# EAGLE design communication-v00 (EAGLE 6.3)
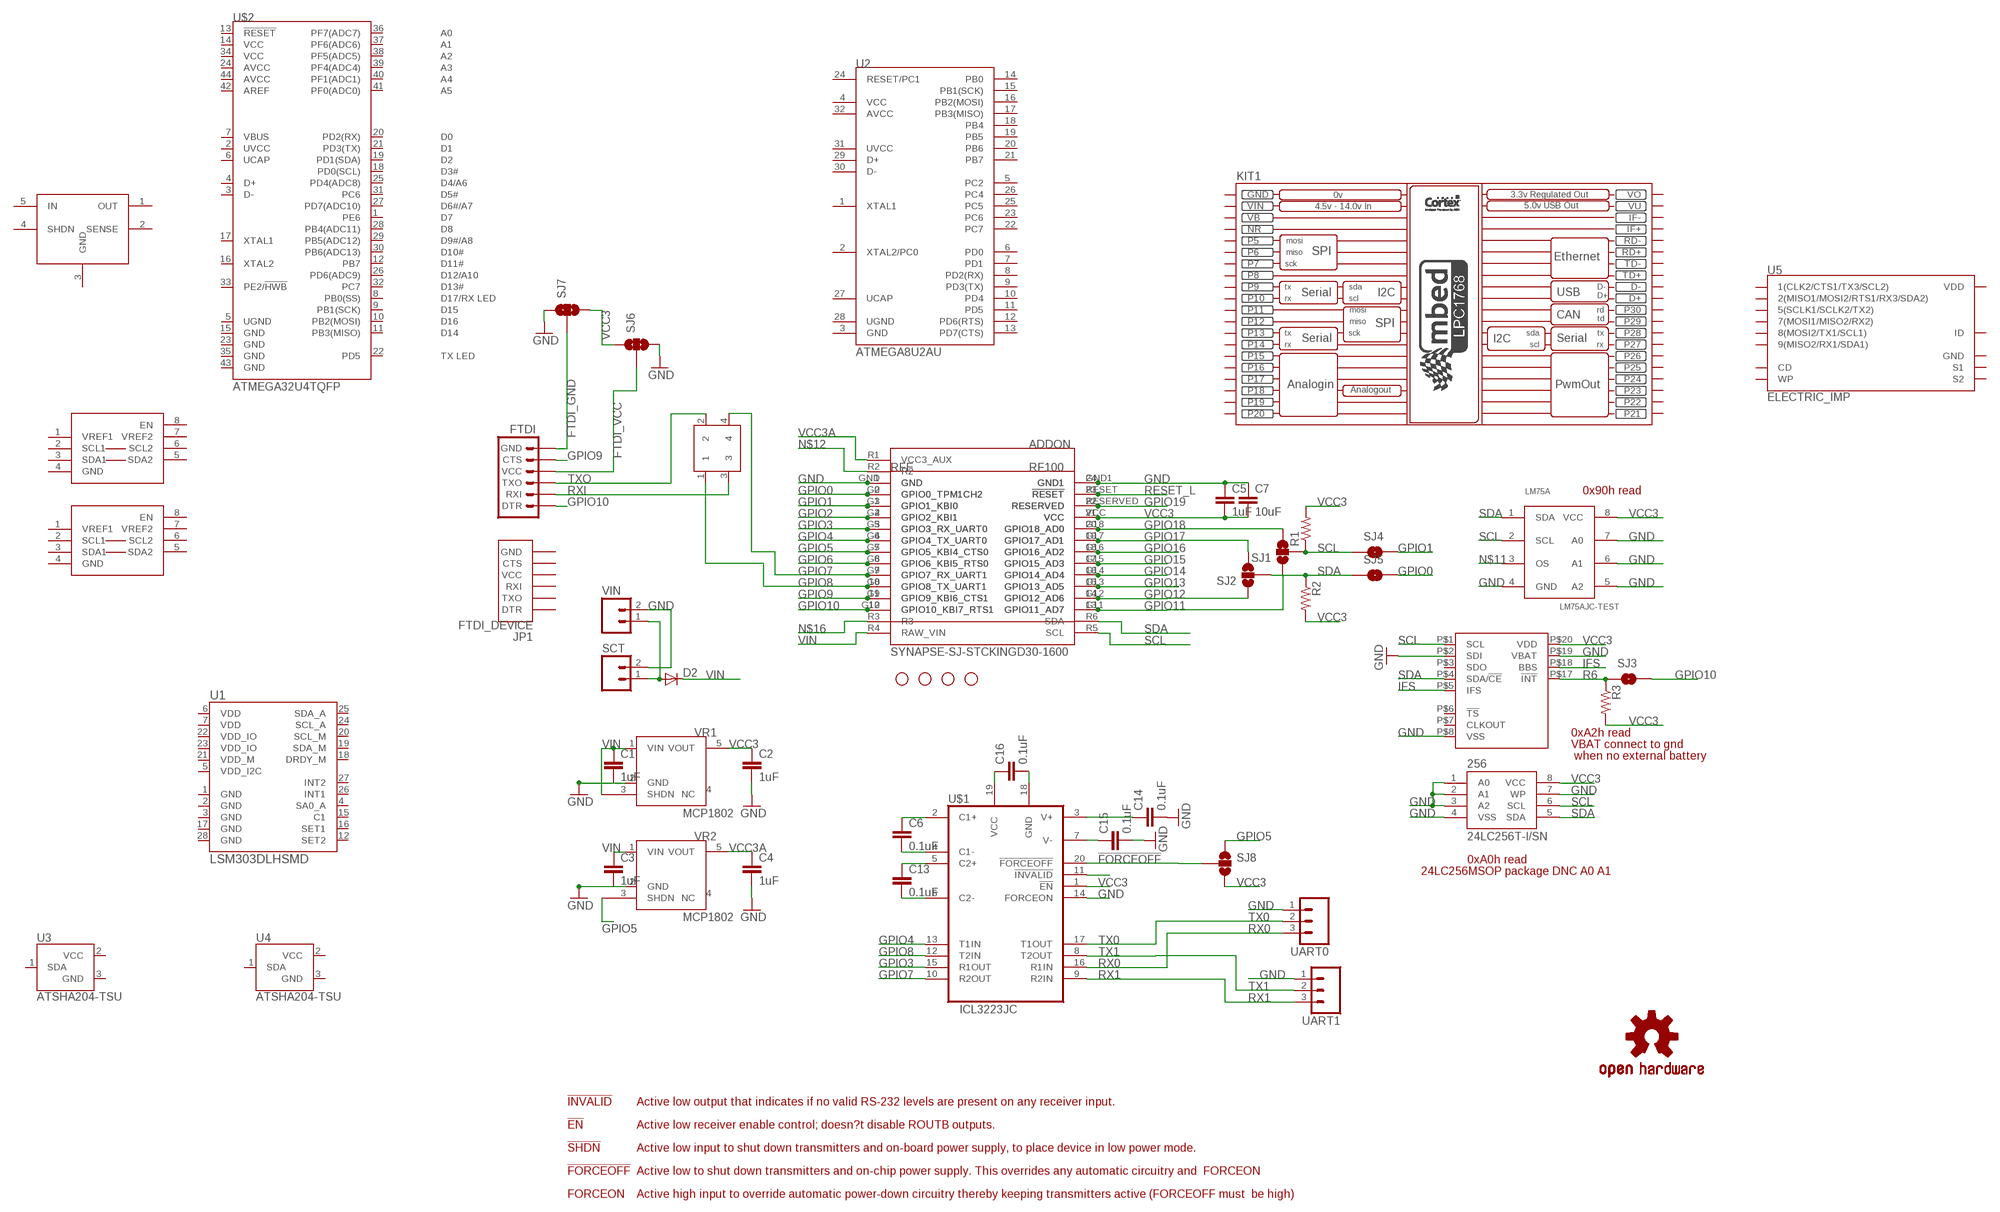
[diagram p0: schematic, sheet 1]

## Parts
256  24LC256T-I/SN  EEPROM-I2CSMD  [SO08]
ADDON  SYNAPSE-SJ-STCKINGD30-1600  [SYNSJ-STACK]
C1  1uF  CAP0805  [0805]
C2  1uF  CAP0805  [0805]
C3  1uF  CAP0805  [0805]
C4  1uF  CAP0805  [0805]
C5  1uF  CAP0805  [0805]
C6  0.1uF  CAP0805  [0805]
C7  10uF  CAP0805  [0805]
C13  0.1uF  CAP0805  [0805]
C14  0.1uF  CAP0805  [0805]
C15  0.1uF  CAP0805  [0805]
C16  0.1uF  CAP0805  [0805]
D2  DIODESMA  [SMA-DIODE]
FTDI  ARDUINO_SERIAL_PROGRAMPTH  [1X06]
JP1  FTDI_DEVICE  [FTDI_DEVICE_SIDE]
JP6  STAND-OFF  [STAND-OFF]
JP9  STAND-OFF  [STAND-OFF]
JP10  STAND-OFF  [STAND-OFF]
JP11  STAND-OFF  [STAND-OFF]
KIT1  MBED_NXP_LPC1768  [MBED-KIT]
LM75A  LM75AJC-TEST  [TSSOP8-3MM]
LOGO1  OSHW-LOGOL  [OSHW-LOGO-L]
PCF2129A  PCF2129ASO20  [SO20W]
R1  RESISTOR  [0805]
R2  RESISTOR  [0805]
R3  RESISTOR  [0805]
RFE  RFE  RF100-JACKJACK2  [SYNAPSERFENGINE-THM-SMT-JACK2]
RXTX  SERIAL_CROSSOVER  [2X02_PTH]
SCT  M023.5MM  [SCREWTERMINAL-3.5MM-2]
SJ1  SOLDERJUMPER_2WAYS  [SJ_3]
SJ2  SOLDERJUMPER_2WAYS  [SJ_3]
SJ3  SOLDERJUMPERNC2  [SJ_2S-NOTRACE]
SJ4  SOLDERJUMPERNO  [SJ_2S-NO]
SJ5  SOLDERJUMPERNO  [SJ_2S-NO]
SJ6  SOLDERJUMPER_2WAYPASTE1&2  [SJ_3_PASTE1&2]
SJ7  SOLDERJUMPER_2WAYPASTE1&2  [SJ_3_PASTE1&2]
SJ8  SOLDERJUMPER_2WAYPASTE1&2  [SJ_3_PASTE1&2]
U1  LSM303DLHSMD  [LGA28-5X5]
U2  ATMEGA8U2AU  [TQFP32-08]
U3  ATSHA204-TSU  [SOT23-3]
U4  ATSHA204-TSU  [SOT23-3]
U5  ELECTRIC_IMP  [SD_MMC_SOCKET]
U$1  ICL3223JC  [TSSOP20-JC]
U$2  ATMEGA32U4TQFP  [SPARKFUN-DIGITALIC_TQFP44]
U$3  PCA9306  [PSOP-8]
U$4  PCA9306  [PSOP-8]
U$5  LT1528  [Q5-DD]
UART0  M03PTH  [1X03]
UART1  M03PTH  [1X03]
VIN  M02PTH  [1X02]
VR1  MCP1802  [SOT23-5]
VR2  MCP1802  [SOT23-5]

## Nets
!FORCEOFF: SJ8.2 U$1.20(!FORCEOFF)
!INVALID: U$1.11(!INVALID)
FTDI_GND: FTDI.6(GND) SJ7.2
FTDI_VCC: FTDI.4(VCC) SJ6.2
GND: 256.1(A0) 256.2(A1) 256.3(A2) 256.4(VSS) 256.7(WP) ADDON.GND ADDON.GND1 C1.2 C2.2 C3.2 C4.2 C5.1 C7.1 C14.2 C15.2 C16.2 LM75A.4(GND) LM75A.5(A2) LM75A.6(A1) LM75A.7(A0) PCF2129A.P$2(SDI) PCF2129A.P$8(VSS) PCF2129A.P$19(VBAT) RFE.1(GND) RFE.24(GND1) RFE.P1 RFE.P24 RFE.P201 RFE.P224 SCT.2 SJ6.3 SJ7.1 U$1.14(FORCEON) U$1.18(GND) UART0.1 UART1.1 VIN.2 VR1.2(GND) VR2.2(GND)
GPIO0: ADDON.G0(GPIO0_TPM1CH2) RFE.2(GPIO0_TPM1CH2) RFE.P2 RFE.P202 SJ5.2
GPIO1: ADDON.G1(GPIO1_KBI0) RFE.3(GPIO1_KBI0) RFE.P3 RFE.P203 SJ4.2
GPIO2: ADDON.G2(GPIO2_KBI1) RFE.4(GPIO2_KBI1) RFE.P4 RFE.P204
GPIO3: ADDON.G3(GPIO3_RX_UART0) RFE.5(GPIO3_RX_UART0) RFE.P5 RFE.P205 U$1.15(R1OUT)
GPIO4: ADDON.G4(GPIO4_TX_UART0) RFE.6(GPIO4_TX_UART0) RFE.P6 RFE.P206 U$1.13(T1IN)
GPIO5: ADDON.G5(GPIO5_KBI4_CTS0) RFE.7(GPIO5_KBI4_CTS0) RFE.P7 RFE.P207 SJ8.1 VR2.3(SHDN)
GPIO6: ADDON.G6(GPIO6_KBI5_RTS0) RFE.8(GPIO6_KBI5_RTS0) RFE.P8 RFE.P208
GPIO7: ADDON.G7(GPIO7_RX_UART1) RFE.9(GPIO7_RX_UART1) RFE.P9 RFE.P209 RXTX.4 U$1.10(R2OUT)
GPIO8: ADDON.G8(GPIO8_TX_UART1) RFE.10(GPIO8_TX_UART1) RFE.P10 RFE.P210 RXTX.1 U$1.12(T2IN)
GPIO9: ADDON.G9(GPIO9_KBI6_CTS1) FTDI.5(CTS) RFE.11(GPIO9_KBI6_CTS1) RFE.P11 RFE.P211
GPIO10: ADDON.G10(GPIO10_KBI7_RTS1) FTDI.1(DTR) RFE.12(GPIO10_KBI7_RTS1) RFE.P12 RFE.P212 SJ3.2
GPIO11: ADDON.G11(GPIO11_AD7) RFE.13(GPIO11_AD7) RFE.P13 RFE.P213 SJ1.1
GPIO12: ADDON.G12(GPIO12_AD6) RFE.14(GPIO12_AD6) RFE.P14 RFE.P214 SJ2.1
GPIO13: ADDON.G13(GPIO13_AD5) RFE.15(GPIO13_AD5) RFE.P15 RFE.P215
GPIO14: ADDON.G14(GPIO14_AD4) RFE.16(GPIO14_AD4) RFE.P16 RFE.P216
GPIO15: ADDON.G15(GPIO15_AD3) RFE.17(GPIO15_AD3) RFE.P17 RFE.P217
GPIO16: ADDON.G16(GPIO16_AD2) RFE.18(GPIO16_AD2) RFE.P18 RFE.P218
GPIO17: ADDON.G17(GPIO17_AD1) RFE.19(GPIO17_AD1) RFE.P19 RFE.P219 SJ2.3
GPIO18: ADDON.G18(GPIO18_AD0) RFE.20(GPIO18_AD0) RFE.P20 RFE.P220 SJ1.3
GPIO19: ADDON.RESERVED RFE.22(RESERVED) RFE.P22 RFE.P222
IFS: PCF2129A.P$5(IFS) PCF2129A.P$18(BBS)
N$1: C13.1 U$1.5(C2+)
N$2: C13.2 U$1.6(C2-)
N$3: C6.1 U$1.2(C1+)
N$5: C6.2 U$1.4(C1-)
N$9: C14.1 U$1.3(V+)
N$10: C15.1 U$1.7(V-)
N$11: LM75A.3(OS)
N$12: ADDON.R2
N$16: ADDON.R3
R6: PCF2129A.P$17(!INT) R3.1 SJ3.1
RESET_L: ADDON.RESET(!RESET) RFE.23(!RESET) RFE.P23 RFE.P223
RX0: U$1.16(R1IN) UART0.3
RX1: U$1.9(R2IN) UART1.3
RXI: FTDI.2(RXI) RXTX.3
SCL: 256.6(SCL) ADDON.R5(SCL) LM75A.2(SCL) PCF2129A.P$1(SCL) R1.1 SJ1.2 SJ4.1
SDA: 256.5(SDA) ADDON.R6(SDA) LM75A.1(SDA) PCF2129A.P$4(SDA/!CE) R2.1 SJ2.2 SJ5.1
TX0: U$1.17(T1OUT) UART0.2
TX1: U$1.8(T2OUT) UART1.2
TXO: FTDI.3(TXO) RXTX.2
VCC3: 256.8(VCC) ADDON.VCC C2.1 C5.2 C7.2 C16.1 LM75A.8(VCC) PCF2129A.P$20(VDD) R1.2 R2.2 R3.2 RFE.21(VCC) RFE.P21 RFE.P221 SJ6.1 SJ7.3 SJ8.3 U$1.1(!EN) U$1.19(VCC) VR1.5(VOUT)
VCC3A: ADDON.R1(VCC3_AUX) C4.1 VR2.5(VOUT)
VIN: ADDON.R4(RAW_VIN) C1.1 C3.1 D2.C VR1.1(VIN) VR1.3(SHDN) VR2.1(VIN)
VIN_PREDIODE: D2.A SCT.1 VIN.1
Unconnected: JP1.P$1(DTR) JP1.P$2(TXO) JP1.P$3(RXI) JP1.P$4(VCC) JP1.P$5(CTS) JP1.P$6(GND) KIT1.D+ KIT1.D- KIT1.IF+ KIT1.IF- KIT1.P$5(P5) KIT1.P$6(P6) KIT1.P$7(P7) KIT1.P$8(P8) KIT1.P$9(P9) KIT1.P$10(P10) KIT1.P$11(P11) KIT1.P$12(P12) KIT1.P$13(P13) KIT1.P$14(P14) KIT1.P$15(P15) KIT1.P$16(P16) KIT1.P$17(P17) KIT1.P$18(P18) KIT1.P$19(P19) KIT1.P$20(P20) KIT1.P$21(P21) KIT1.P$22(P22) KIT1.P$23(P23) KIT1.P$24(P24) KIT1.P$25(P25) KIT1.P$26(P26) KIT1.P$27(P27) KIT1.P$28(P28) KIT1.P$29(P29) KIT1.P$30(P30) KIT1.RD+ KIT1.RD- KIT1.TD+ KIT1.TD- PCF2129A.P$3(SDO) PCF2129A.P$6(!TS) PCF2129A.P$7(CLKOUT) U1.1(GND) U1.2(GND) U1.3(GND) U1.4(SA0_A) U1.5(VDD_I2C) U1.6(VDD) U1.7(VDD) U1.12(SET2) U1.15(C1) U1.16(SET1) U1.17(GND) U1.18(DRDY_M) U1.19(SDA_M) U1.20(SCL_M) U1.21(VDD_M) U1.22(VDD_IO) U1.23(VDD_IO) U1.24(SCL_A) U1.25(SDA_A) U1.26(INT1) U1.27(INT2) U1.28(GND) U2.1(XTAL1) U2.2(XTAL2/PC0) U2.3(GND) U2.4(VCC) U2.5(PC2) U2.6(PD0) U2.7(PD1) U2.8(PD2(RX)) U2.9(PD3(TX)) U2.10(PD4) U2.11(PD5) U2.12(PD6(RTS)) U2.13(PD7(CTS)) U2.14(PB0) U2.15(PB1(SCK)) U2.16(PB2(MOSI)) U2.17(PB3(MISO)) U2.18(PB4) U2.19(PB5) U2.20(PB6) U2.21(PB7) U2.22(PC7) U2.23(PC6) U2.24(RESET/PC1) U2.25(PC5) U2.26(PC4) U2.27(UCAP) U2.28(UGND) U2.29(D+) U2.30(D-) U2.31(UVCC) U2.32(AVCC) U3.1(SDA) U3.2(VCC) U3.3(GND) U4.1(SDA) U4.2(VCC) U4.3(GND) U5.1(1(CLK2/CTS1/TX3/SCL2)) U5.2(2(MISO1/MOSI2/RTS1/RX3/SDA2)) U5.3(GND) U5.4(VDD) U5.5(5(SCLK1/SCLK2/TX2)) U5.6(ID) U5.7(7(MOSI1/MISO2/RX2)) U5.8(8(MOSI2/TX1/SCL1)) U5.9(9(MISO2/RX1/SDA1)) U5.CD U5.S1 U5.S2 U5.WP U$2.1(PE6) U$2.2(UVCC) U$2.3(D-) U$2.4(D+) U$2.5(UGND) U$2.6(UCAP) U$2.7(VBUS) U$2.8(PB0(SS)) U$2.9(PB1(SCK)) U$2.10(PB2(MOSI)) U$2.11(PB3(MISO)) U$2.12(PB7) U$2.13(!RESET) U$2.14(VCC) U$2.15(GND) U$2.16(XTAL2) U$2.17(XTAL1) U$2.18(PD0(SCL)) U$2.19(PD1(SDA)) U$2.20(PD2(RX)) U$2.21(PD3(TX)) U$2.22(PD5) U$2.23(GND) U$2.24(AVCC) U$2.25(PD4(ADC8)) U$2.26(PD6(ADC9)) U$2.27(PD7(ADC10)) U$2.28(PB4(ADC11)) U$2.29(PB5(ADC12)) U$2.30(PB6(ADC13)) U$2.31(PC6) U$2.32(PC7) U$2.33(PE2/!HWB) U$2.34(VCC) U$2.35(GND) U$2.36(PF7(ADC7)) U$2.37(PF6(ADC6)) U$2.38(PF5(ADC5)) U$2.39(PF4(ADC4)) U$2.40(PF1(ADC1)) U$2.41(PF0(ADC0)) U$2.42(AREF) U$2.43(GND) U$2.44(AVCC) U$3.1(VREF1) U$3.2(SCL1) U$3.3(SDA1) U$3.4(GND) U$3.5(SDA2) U$3.6(SCL2) U$3.7(VREF2) U$3.8(EN) U$4.1(VREF1) U$4.2(SCL1) U$4.3(SDA1) U$4.4(GND) U$4.5(SDA2) U$4.6(SCL2) U$4.7(VREF2) U$4.8(EN) U$5.1(OUT) U$5.2(SENSE) U$5.3(GND) U$5.4(SHDN) U$5.5(IN) VR1.4(NC) VR2.4(NC)

## Notes on the sheet
- 0x90h read
- 0xA2h read
- VBAT connect to gnd
- when no external battery
- 0xA0h read
- 24LC256MSOP package DNC A0 A1
- !INVALID | Active low output that indicates if no valid RS-232 levels are present on any receiver input.
- !EN | Active low receiver enable control; doesn?t disable ROUTB outputs.
- !SHDN | Active low input to shut down transmitters and on-board power supply, to place device in low power mode.
- !FORCEOFF | Active low to shut down transmitters and on-chip power supply. This overrides any automatic circuitry and  FORCEON
- FORCEON | Active high input to override automatic power-down circuitry thereby keeping transmitters active (FORCEOFF must  be high)

## Power pins joined to a net without a drawn wire
GND: KIT1.GND
NR: KIT1.NR
VB: KIT1.VB
VIN: KIT1.VIN
VO: KIT1.VOUT(VO)
VU: KIT1.VU

## Library data of the parts
256 = SparkFun:EEPROM-I2C
ADDON = 0_jc-custom:SYNAPSE-SJ-STCKING: Standard layout for expansion modules using Synapse Wireless boards
C1-C7 C13-C16 = 0_jc-custom:CAP: Capacitor Standard 0603 ceramic capacitor, and 0.1" leaded capacitor.
D2 = SparkFun:DIODE: Diode These are standard reverse protection diodes and small signal diodes. SMA package can handle up to about 1A. SOD-323 can handle about 200mA. What the SOD-323 package when ordering, there are some mfgs out there that are 5-pin packages.
FTDI = SparkFun:ARDUINO_SERIAL_PROGRAM
JP1 = SparkFun-Connectors:FTDI_DEVICE: Connector which mates to FTDI basic or FTDI cable.
JP6 JP9-JP11 = SparkFun:STAND-OFF: Stand Off This is the mechanical footprint for a #4 phillips button head screw. Use the keepout ring to avoid running the screw head into surrounding components. SKU : PRT-00447
KIT1 = MBED_v2.1:MBED_NXP_LPC1768: Mbed LPC1768 - ARM CORTEX v2.1 * Schematic symbol is now placed in eagles's default raster. *The pads diameter are suitable for routing between mbed pins * mbed pads are 0.8 mm drill diameter. --------------------------------------------- Created by: Mohamed Yousry *Alexandria, Egypt *Email: mohamed.yousry@ieeegoldegypt.org
LM75A = 0_jc-custom:LM75A
LOGO1 = SparkFun-Aesthetics:OSHW-LOGO: Open Source Hardware Logo This logo indicates the piece of hardware it is found on incorporates a OSHW license and/or adheres to the definition of open source hardware found here: http://freedomdefined.org/OSHW
PCF2129A = 0_jc-custom:PCF2129A
R1-R3 = SparkFun:RESISTOR: Resistor Basic schematic elements and footprints for 0603, 1206, and PTH 1/10th watt (small) resistors.
RFE = 0_jc-custom:RF100-JACK
RXTX = 0_jc-custom:SERIAL_CROSSOVER
SCT VIN = SparkFun:M02: Header 2 Standard 2-pin 0.1" header. Use with straight break away headers (SKU : PRT-00116), right angle break away headers (PRT-00553), swiss pins (PRT-00743), machine pins (PRT-00117), and female headers (PRT-00115). Molex polarized connector foot print use with SKU : PRT-08233 with associated crimp pins and housings.
SJ1 SJ2 SJ6-SJ8 = SparkFun:SOLDERJUMPER_2WAY: Solder Jumper 2 way solder jumper
SJ3-SJ5 = SparkFun:SOLDERJUMPER: Solder Jumper Standard SMD solder jumper. Used to automate production. Two varients : Normally Open and Normally Closed are the same, but have different paste layers. NC will have a large amount of paste and should jumper during reflow.
U1 = SparkFun-Sensors:LSM303DLH: I2C accelerometer/magnetometer/tilt compensated compass
U2 = SparkFun-DigitalIC:ATMEGA8U2: Atmel 32-pin 8-bit Microcontroller with 8/16/32K Bystes of ISP Flash and USB Controller. ATmega8U2, ATmega16U2, and ATmega32U2
U3 U4 = SparkFun-DigitalIC:ATSHA204: Atmel ATSHA204 The Atmel ATSHA204 is an optimized authentication chip that includes a 4.5Kb EEPROM. This array can be used for storage of keys, miscellaneous read/write, read-only, password or secret data, and consumption tracking. Access to the various sections of memory can be restricted in a variety of ways and then the configuration locked to prevent changes.
U5 = SparkFun-RF:ELECTRIC_IMP: Electric Imp SD Socket This symbol matches the Electric Imp <https://www.sparkfun.com/products/11395> pinout to a 4UCONN SD MMC connector. The 4UCONN part number is 19646 <http://www.4uconnector.com/online/Itemadrawing.asp?fldseries=19646&seriesno_a=12>. See this part in action on the Electric Imp Breakout <https://www.sparkfun.com/products/11400>.
U$1 = 0_jc-custom:ICL3223
U$2 = SparkFun-DigitalIC:ATMEGA32U4: Atmel 44-pin 8-bit Microcontroller with 32KBytes of ISP Flash and USB Controller
U$3 U$4 = SparkFun-DigitalIC:PCA9306: Bidirectional I2C level shifter. NOT compatible with all available part number pinout schemes- DOUBLE CHECK!!!
U$5 = SparkFun-PowerIC:LT1528: High current voltage regulator commonly used with GM862 cellular module. Spark Fun Electronics SKU : COM-00311. Footprint may need to have the large paste aperature reduced.
UART0 UART1 = SparkFun:M03: Header 3 Standard 3-pin 0.1" header. Use with straight break away headers (SKU : PRT-00116), right angle break away headers (PRT-00553), swiss pins (PRT-00743), machine pins (PRT-00117), and female headers (PRT-00115). Molex polarized connector foot print use with SKU : PRT-08232 with associated crimp pins and housings.
VR1 VR2 = 0_jc-custom:MCP1802

## Net classes
0 default: width 0.254 mm
1 Power: width 0.508 mm
2 smallsignal: width 0.152 mm
3 stdsignal: width 0.254 mm

## Board
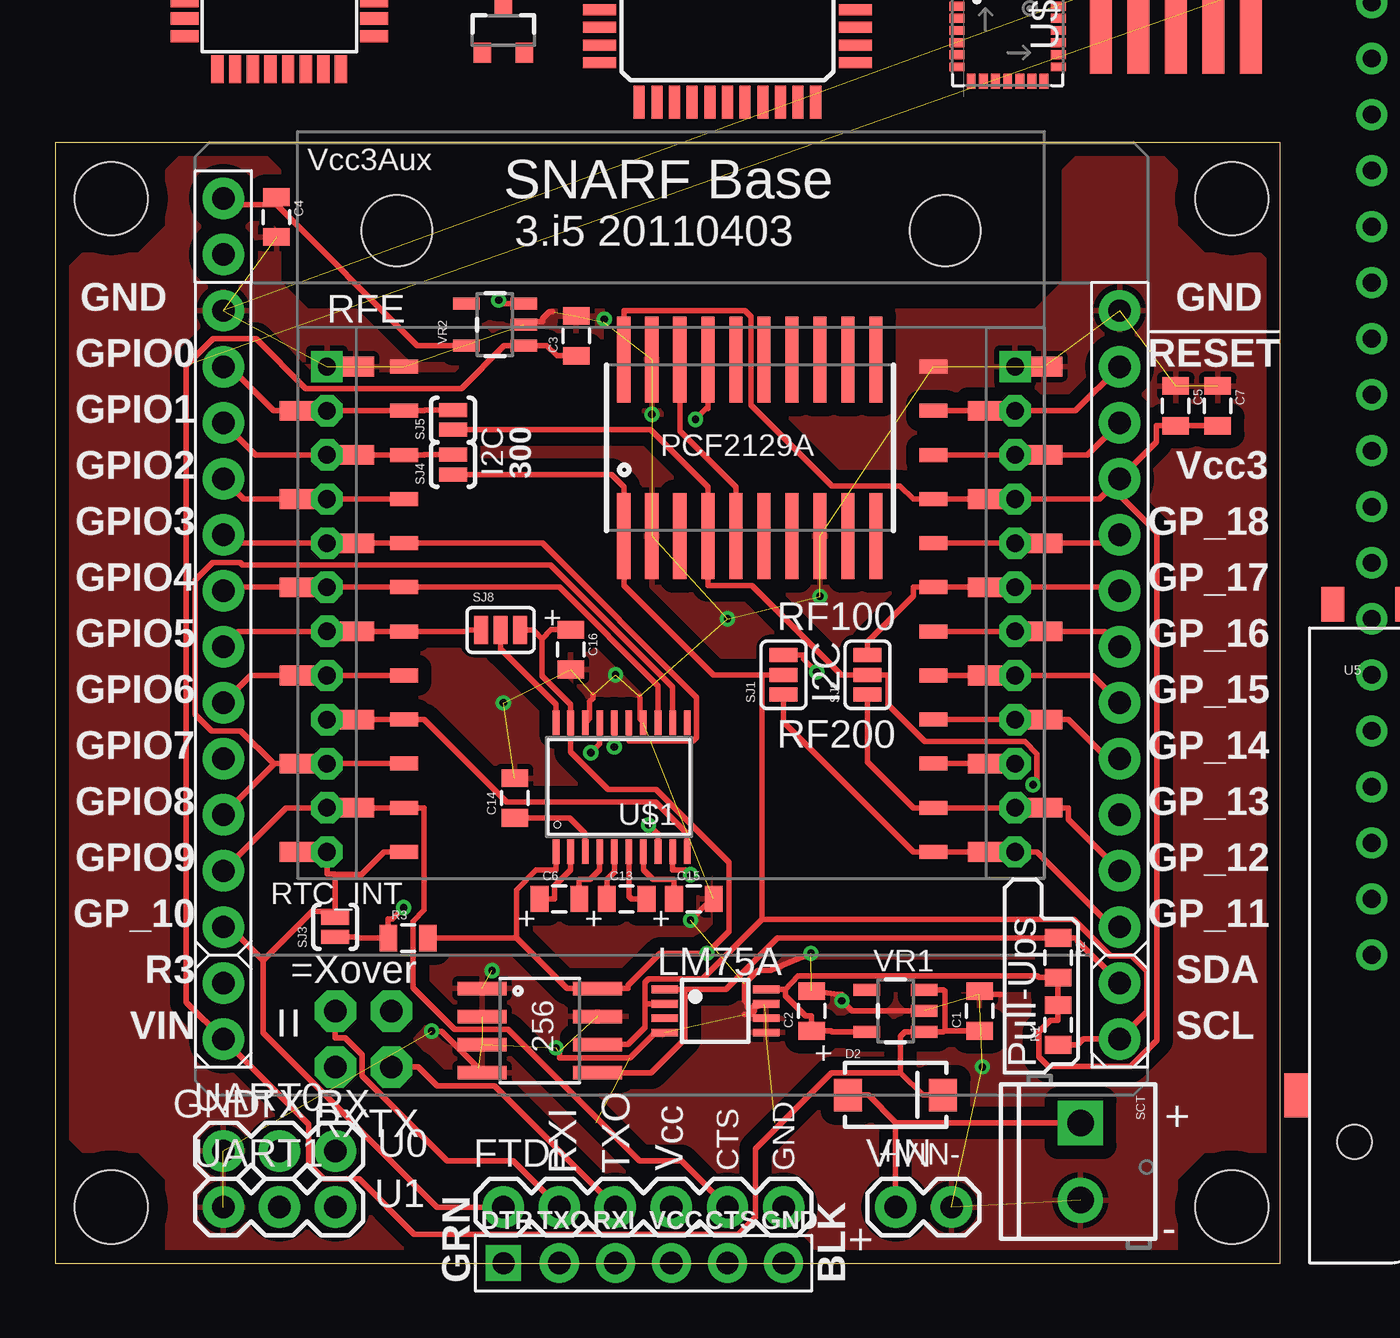
[diagram p1: board, top side]
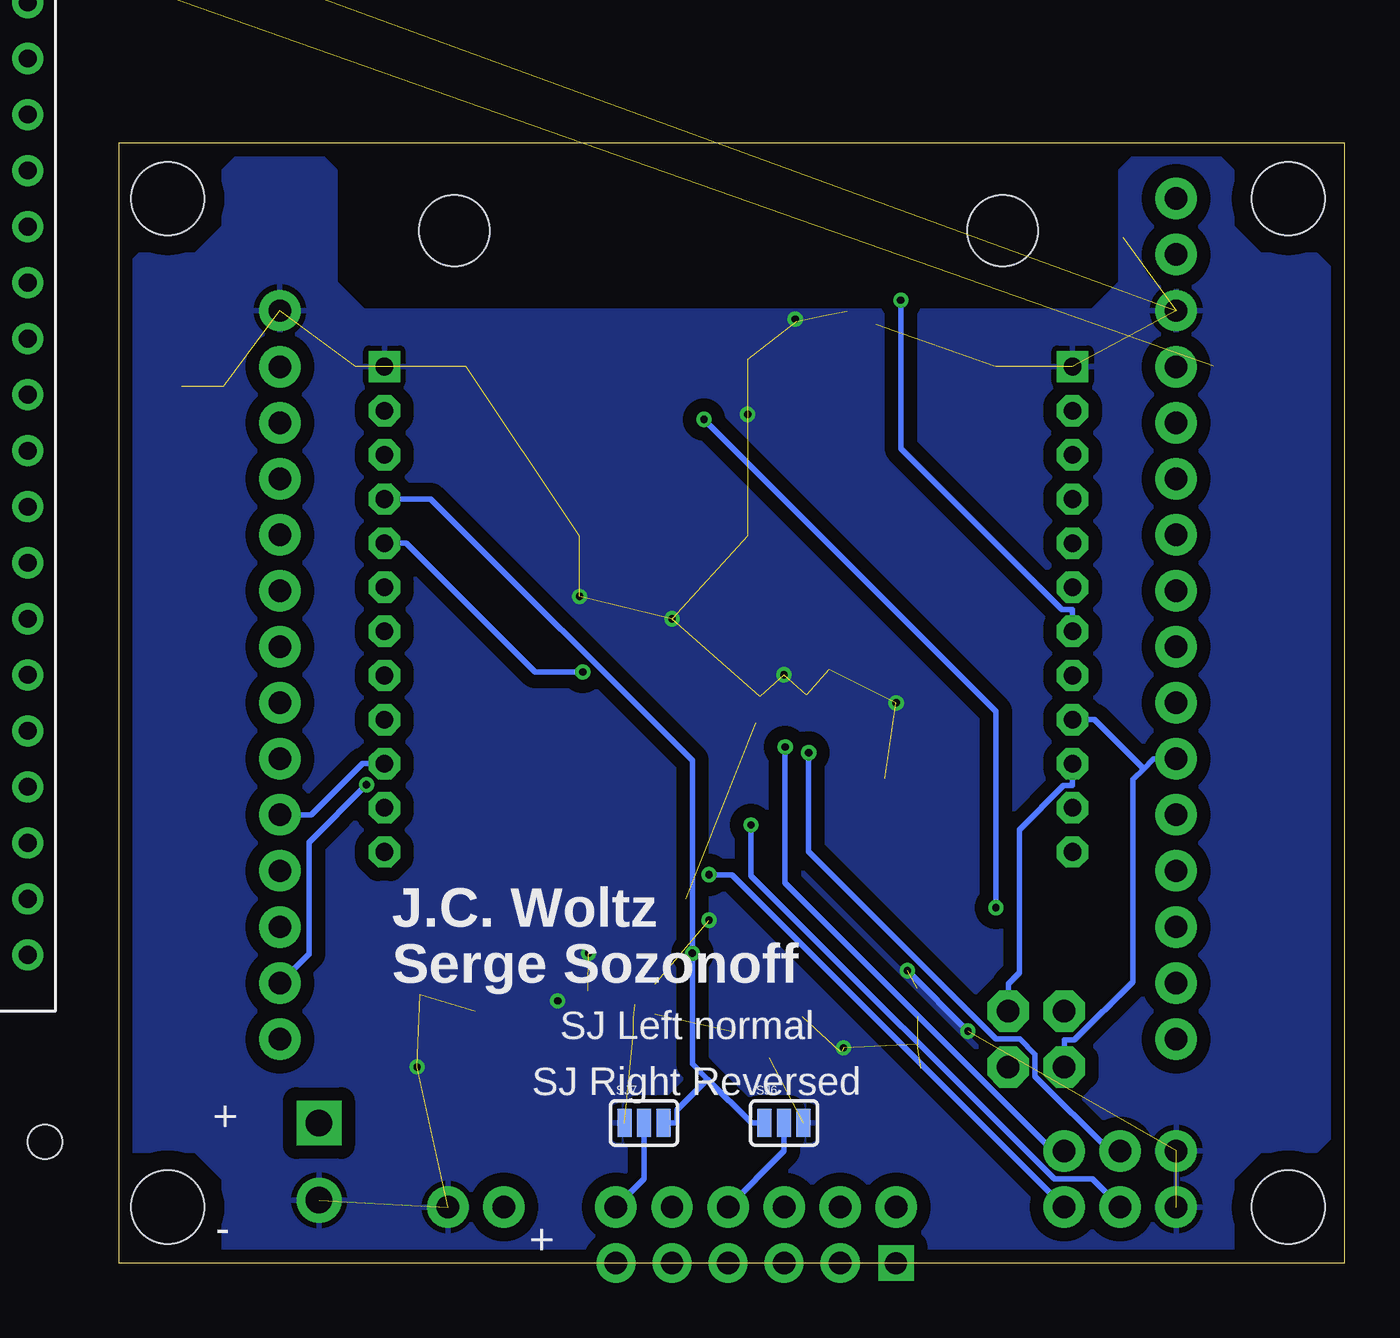
[diagram p2: board, bottom side, seen from below]

Size 55.55 x 50.79 mm. Coordinates in mm from the lower left corner, seen from the top.
Outline: 0,0 55.55,0 55.55,50.79 0,50.79 0,0
Copper layers (1*16): Top 0.0356mm / dielectric 1.5011mm / Bottom 0.0356mm
Design rules "LaenPCBOrder-JCModified": minimum track width 6mil, minimum drill 13mil, track to track 6mil, track to pad 6mil, pad to pad 6mil, via to via 6mil, smd to smd 6mil, copper to edge 15mil, drill to drill 6mil, minimum pad ring 12mil, minimum via ring 7mil, stop-mask expansion 4mil, vias tented up to drill 25mil, thermal gap 10mil

### Footprints (pad centres in the part's own frame; a part is rotated, then mirrored left to right if it is on the bottom)
SO08 = smd 0.61 x 2.21: 1 -1.905,-2.616; 2 -0.635,-2.616; 3 0.635,-2.616; 4 1.905,-2.616; 5 1.905,2.616; 6 0.635,2.616; 7 -0.635,2.616; 8 -1.905,2.616
SYNSJ-STACK = drill 1.016 pad 1.88: G0 0,-7.62; G1 0,-10.16; G2 0,-12.7; G3 0,-15.24; G4 0,-17.78; G5 0,-20.32; G6 0,-22.86; G7 0,-25.4; G8 0,-27.94; G9 0,-30.48; G10 0,-33.02; G11 40.64,-33.02; G12 40.64,-30.48; G13 40.64,-27.94; G14 40.64,-25.4; G15 40.64,-22.86; G16 40.64,-20.32; G17 40.64,-17.78; G18 40.64,-15.24; GND 0,-5.08; GND1 40.64,-5.08; R1 0,0; R2 0,-2.54; R3 0,-35.56; R4 0,-38.1; R5 40.64,-38.1; R6 40.64,-35.56; RESERVED 40.64,-10.16; RESET 40.64,-7.62; VCC 40.64,-12.7
0805 = smd 0.8 x 1.2: 1 -0.9,0; 2 0.9,0
SMA-DIODE = smd 1.27 x 1.47: A -2.15,0; C 2.15,0
1X06 = drill 1.016 pad 1.88: 1 0,0; 2 2.54,0; 3 5.08,0; 4 7.62,0; 5 10.16,0; 6 12.7,0
FTDI_DEVICE_SIDE = drill 1 square: P$1 -6.35,0 | drill 1.016 pad 1.778: P$2 -3.81,0; P$3 -1.27,0; P$4 1.27,0; P$5 3.81,0; P$6 6.35,0
STAND-OFF = hole 3.302: 0,0
MBED-KIT = drill 0.8: D+ 11.43,1.27; D- 11.43,3.81; GND -11.43,24.13; IF+ 11.43,16.51; IF- 11.43,19.05; NR -11.43,16.51; P$5 -11.43,13.97; P$6 -11.43,11.43; P$7 -11.43,8.89; P$8 -11.43,6.35; P$9 -11.43,3.81; P$10 -11.43,1.27; P$11 -11.43,-1.27; P$12 -11.43,-3.81; P$13 -11.43,-6.35; P$14 -11.43,-8.89; P$15 -11.43,-11.43; P$16 -11.43,-13.97; P$17 -11.43,-16.51; P$18 -11.43,-19.05; P$19 -11.43,-21.59; P$20 -11.43,-24.13; P$21 11.43,-24.13; P$22 11.43,-21.59; P$23 11.43,-19.05; P$24 11.43,-16.51; P$25 11.43,-13.97; P$26 11.43,-11.43; P$27 11.43,-8.89; P$28 11.43,-6.35; P$29 11.43,-3.81; P$30 11.43,-1.27; RD+ 11.43,11.43; RD- 11.43,13.97; TD+ 11.43,6.35; TD- 11.43,8.89; VB -11.43,19.05; VIN -11.43,21.59; VOUT 11.43,24.13; VU 11.43,21.59
TSSOP8-3MM = smd 1.2 x 0.35: 1 -2.6,0.975; 2 -2.6,0.325; 3 -2.6,-0.325; 4 -2.6,-0.975; 5 2,-0.975; 6 2,-0.325; 7 2,0.325; 8 2,0.975
SO20W = smd 0.6 x 3.9: P$1 -5.715,-4; P$2 -4.445,-4; P$3 -3.175,-4; P$4 -1.905,-4; P$5 -0.635,-4; P$6 0.635,-4; P$7 1.905,-4; P$8 3.175,-4; P$9 4.445,-4; P$10 5.715,-4; P$11 5.715,4; P$12 4.445,4; P$13 3.175,4; P$14 1.905,4; P$15 0.635,4; P$16 -0.635,4; P$17 -1.905,4; P$18 -3.175,4; P$19 -4.445,4; P$20 -5.715,4
SYNAPSERFENGINE-THM-SMT-JACK2 = drill 0.8 square: 1 0,0; 24 31.2,0 | drill 0.8 pad 1.422 octagon: 2 0,-2; 3 0,-4; 4 0,-6; 5 0,-8; 6 0,-10; 7 0,-12; 8 0,-14; 9 0,-16; 10 0,-18; 11 0,-20; 12 0,-22; 13 31.2,-22; 14 31.2,-20; 15 31.2,-18; 16 31.2,-16; 17 31.2,-14; 18 31.2,-12; 19 31.2,-10; 20 31.2,-8; 21 31.2,-6; 22 31.2,-4; 23 31.2,-2 | smd 1.67 x 0.89: P1 1.3,0; P2 -1.3,-2; P3 1.3,-4; P4 -1.3,-6; P5 1.3,-8; P6 -1.3,-10; P7 1.3,-12; P8 -1.3,-14; P9 1.3,-16; P10 -1.3,-18; P11 1.3,-20; P12 -1.3,-22; P13 29.9,-22; P14 32.5,-20; P15 29.9,-18; P16 32.5,-16; P17 29.9,-14; P18 32.5,-12; P19 29.9,-10; P20 32.5,-8; P21 29.9,-6; P22 32.5,-4; P23 29.9,-2; P24 32.5,0 | smd 1.27 x 0.635: P201 3.5,0; P202 3.5,-2; P203 3.5,-4; P204 3.5,-6; P205 3.5,-8; P206 3.5,-10; P207 3.5,-12; P208 3.5,-14; P209 3.5,-16; P210 3.5,-18; P211 3.5,-20; P212 3.5,-22; P213 27.5,-22; P214 27.5,-20; P215 27.5,-18; P216 27.5,-16; P217 27.5,-14; P218 27.5,-12; P219 27.5,-10; P220 27.5,-8; P221 27.5,-6; P222 27.5,-4; P223 27.5,-2; P224 27.5,0 | hole 3.2: 3.17,6.16; 28.03,6.16
2X02_PTH = drill 1.016 pad 1.88 octagon: 1 -1.27,-1.27; 2 -1.27,1.27; 3 1.27,-1.27; 4 1.27,1.27
SCREWTERMINAL-3.5MM-2 = drill 1.2 pad 2.032 square: 1 0,0 | drill 1.2 pad 2.032: 2 3.5,0
SJ_3 = smd 0.635 x 1.27: 1 -0.889,0; 2 0,0; 3 0.889,0
SJ_2S-NOTRACE = smd 0.635 x 1.27: 1 -0.45,0; 2 0.4,0
SJ_2S-NO = smd 0.635 x 1.27: 1 -0.45,0; 2 0.45,0
SJ_3_PASTE1&2 = smd 0.635 x 1.27: 1 -0.889,0; 2 0,0; 3 0.889,0
LGA28-5X5 = smd 0.7 x 0.4: 1 -2.3,1.65; 2 -2.3,1.1; 3 -2.3,0.55; 4 -2.3,0; 5 -2.3,-0.55; 6 -2.3,-1.1; 7 -2.3,-1.65; 15 2.3,-1.65; 16 2.3,-1.1; 17 2.3,-0.55; 18 2.3,0; 19 2.3,0.55; 20 2.3,1.1; 21 2.3,1.65 | smd 0.4 x 0.7: 8 -1.65,-2.3; 9 -1.1,-2.3; 10 -0.55,-2.3; 11 0,-2.3; 12 0.55,-2.3; 13 1.1,-2.3; 14 1.65,-2.3; 22 1.65,2.3; 23 1.1,2.3; 24 0.55,2.3; 25 0,2.3; 26 -0.55,2.3; 27 -1.1,2.3; 28 -1.65,2.3
TQFP32-08 = smd 1.27 x 0.559: 1 -4.293,2.8; 2 -4.293,2; 3 -4.293,1.2; 4 -4.293,0.4; 5 -4.293,-0.4; 6 -4.293,-1.2; 7 -4.293,-2; 8 -4.293,-2.8; 17 4.293,-2.8; 18 4.293,-2; 19 4.293,-1.2; 20 4.293,-0.4; 21 4.293,0.4; 22 4.293,1.2; 23 4.293,2; 24 4.293,2.8 | smd 0.559 x 1.27: 9 -2.8,-4.293; 10 -2,-4.293; 11 -1.2,-4.293; 12 -0.4,-4.293; 13 0.4,-4.293; 14 1.2,-4.293; 15 2,-4.293; 16 2.8,-4.293; 25 2.8,4.293; 26 2,4.293; 27 1.2,4.293; 28 0.4,4.293; 29 -0.4,4.293; 30 -1.2,4.293; 31 -2,4.293; 32 -2.8,4.293
SOT23-3 = smd 0.8 x 0.9: 1 -0.95,-1; 2 0.95,-1; 3 0,1.1
SD_MMC_SOCKET = smd 1.05 x 1.56: 1 6.77,29.87; 2 4.27,29.87; 3 2.52,29.87; 4 -0.73,29.87; 5 -3.23,29.87; 6 -5.73,29.87; 7 -8.15,29.87; 8 -9.85,29.87; 9 9.27,29.87; CD 1.02,29.87; WP -13.2,29.87 | smd 1.2 x 2: S1 -14.8,7.6; S2 14.8,8.8 | hole 1.55: 11.98,5.5; -12.22,5.5
TSSOP20-JC = smd 1.1 x 0.3: 1 -2.937,2.693; 2 -2.937,2.032; 3 -2.937,1.372; 4 -2.937,0.712; 5 -2.937,0.051; 6 -2.937,-0.609; 7 -2.937,-1.27; 8 -2.943,-1.93; 9 -2.937,-2.59; 10 -2.937,-3.251; 11 2.905,-3.251; 12 2.905,-2.59; 13 2.911,-1.93; 14 2.905,-1.27; 15 2.905,-0.609; 16 2.905,0.051; 17 2.905,0.712; 18 2.905,1.372; 19 2.905,2.032; 20 2.905,2.693
SPARKFUN-DIGITALIC_TQFP44 = smd 1.5 x 0.5: 1 -5.8,4; 2 -5.8,3.2; 3 -5.8,2.4; 4 -5.8,1.6; 5 -5.8,0.8; 6 -5.8,0; 7 -5.8,-0.8; 8 -5.8,-1.6; 9 -5.8,-2.4; 10 -5.8,-3.2; 11 -5.8,-4; 23 5.8,-4; 24 5.8,-3.2; 25 5.8,-2.4; 26 5.8,-1.6; 27 5.8,-0.8; 28 5.8,0; 29 5.8,0.8; 30 5.8,1.6; 31 5.8,2.4; 32 5.8,3.2; 33 5.8,4 | smd 0.5 x 1.5: 12 -4,-5.8; 13 -3.2,-5.8; 14 -2.4,-5.8; 15 -1.6,-5.8; 16 -0.8,-5.8; 17 0,-5.8; 18 0.8,-5.8; 19 1.6,-5.8; 20 2.4,-5.8; 21 3.2,-5.8; 22 4,-5.8; 34 4,5.8; 35 3.2,5.8; 36 2.4,5.8; 37 1.6,5.8; 38 0.8,5.8; 39 0,5.8; 40 -0.8,5.8; 41 -1.6,5.8; 42 -2.4,5.8; 43 -3.2,5.8; 44 -4,5.8
PSOP-8 = smd 0.25 x 0.5: 1 -0.73,-1.37; 2 -0.23,-1.37; 3 0.27,-1.37; 4 0.77,-1.37; 5 0.77,1.38; 6 0.27,1.38; 7 -0.23,1.38; 8 -0.73,1.38
Q5-DD = smd 1 x 3.4: 1 -3.4,-7.875; 2 -1.7,-7.875; 3 0,-7.875; 4 1.7,-7.875; 5 3.4,-7.875 | smd 10.414 x 9.525: 6 0,0.325
1X03 = drill 1.016 pad 1.88: 1 0,0; 2 2.54,0; 3 5.08,0
1X02 = drill 1.016 pad 1.88: 1 0,0; 2 2.54,0
SOT23-5 = smd 0.55 x 1.2: 1 -0.95,-1.3; 2 0,-1.3; 3 0.95,-1.3; 4 0.95,1.3; 5 -0.95,1.3

### Placement (x,y rotation side)
256  21.97,10.54 270 top
ADDON  7.62,48.26 0 top
C1  41.91,11.43 90 top
C2  34.29,11.43 90 top
C3  23.62,42.04 90 top
C4  10.03,47.42 270 top
C5  50.8,38.86 270 top
C6  22.86,16.51 0 top
C7  52.7,38.86 270 top
C13  25.91,16.51 0 top
C14  20.83,21.08 90 top
C15  28.96,16.51 0 top
C16  23.37,27.81 270 top
D2  38.1,7.62 0 top
FTDI  20.32,2.54 0 top
JP1  26.67,0 0 top
JP6  53.34,2.54 0 top
JP9  2.54,2.54 0 top
JP10  53.34,48.26 0 top
JP11  2.54,48.26 0 top
KIT1  71.12,38.1 0 top  (outside the outline)
LM75A  30.23,11.43 0 top
LOGO1  25.4,68.58 0 top  (outside the outline)
PCF2129A  31.5,36.96 0 top
R1  45.47,10.79 90 top
R2  45.47,13.84 270 top
R3  16,14.73 0 top
RFE  12.32,40.64 0 top
RXTX  13.97,10.16 180 top
SCT  46.48,6.35 270 top
SJ1  33.02,26.67 90 top
SJ2  36.83,26.67 90 top
SJ3  12.7,15.24 90 top
SJ4  18.03,36.2 90 top
SJ5  18.03,38.23 90 top
SJ6  25.4,6.35 0 bottom
SJ7  31.75,6.35 0 bottom
SJ8  20.19,28.7 0 top
U1  43.18,55.88 0 top
U2  10.16,58.42 0 top  (outside the outline)
U3  20.32,55.88 0 top  (outside the outline)
U4  71.12,7.62 0 top  (outside the outline)
U5  71.12,0 0 top
U$1  25.4,21.59 90 top
U$2  30.48,58.42 0 top
U$3  20.32,60.96 0 top  (outside the outline)
U$4  40.64,63.5 0 top  (outside the outline)
U$5  50.8,63.5 0 top  (outside the outline)
UART0  7.62,5.08 0 top
UART1  7.62,2.54 0 top
VIN  38.1,2.54 0 top
VR1  38.1,11.43 90 top
VR2  19.94,42.55 90 top

### Tracks (layer width: path | path; a pad name or v marks a point on that pad's centre or on a via)
!FORCEOFF
  Top 0.254: SJ8.2 20.19,27.79 20.24,27.79 22.71,25.32 U$1.20
FTDI_GND
  Bottom 0.254: SJ7.2 31.75,3.81 FTDI.6
FTDI_VCC
  Bottom 0.254: SJ6.2 25.4,5.08 FTDI.4
GND  (via drill 0.33, 0.33 pad 0.61)  (46 unrouted)
  Top 0.254: LM75A.4 27.58,10.36 27.13,10.36 26.06,9.3 22.86,9.3 22.86,9.6 22.77,9.6 | 31.7,11.58 31.7,11.43 31.55,11.28 31.24,11.28 | 31.7,11.58 31.7,11.73 32.16,11.73 LM75A.7 31.7,11.58 | 31.7,11.58 31.39,11.58 31.39,11.73 31.24,11.89 31.24,12.65 31.85,13.26 32.46,13.26 32.48,13.29 v34.27,14.05 | 22.55,43.13 22.4,43.13 22.1,42.82 22.1,42.67 21.34,42.67 VR2.2 | 24.38,25.76 24.38,25.6 24.23,25.45 24.23,24.69 24.08,24.54 U$1.18 | U$1.14 26.67,24.54 26.52,24.69 26.52,25.6 26.49,25.68 | v28.8,15.54 29.72,16.46 C15.2 | C1.2 41.91,12.19 42.82,12.19 42.87,12.17 | 24.77,42.67 24.84,42.67 v24.89,42.8 | 35.51,12.19 35.66,12.19 v35.66,11.89 36.12,11.43 VR1.2 | 35.51,12.19 35.49,12.19 | v17.07,10.52 17.53,10.52 19.2,8.84 256.4 | C2.2 35.51,12.19
  Bottom 0.254: v28.8,15.54 28.72,15.54 | v17.07,10.52 v19.81,13.26
  other vias: 20.32,25.4 25.4,26.67 30.48,29.21 34.67,30.23 27.05,38.48 22.71,9.75 42.04,8.89
  pour Top (isolate 0.61): 0,44.45 0,6.35 1.27,5.08 3.81,5.08 5.08,3.81 5.08,0 50.8,0 50.8,3.81 52.07,5.08 55.88,5.08 55.88,44.45 54.61,45.72 52.07,45.72 50.8,46.99 50.8,49.53 49.53,50.8 46.99,50.8 45.72,49.53 45.72,44.45 44.45,43.18 11.43,43.18 10.16,44.45 10.16,49.53 8.89,50.8 6.35,50.8 5.08,49.53 5.08,46.99 3.81,45.72 1.27,45.72
  pour Bottom (isolate 0.61): 0,44.45 0,6.35 1.27,5.08 3.81,5.08 5.08,3.81 5.08,0 50.8,0 50.8,3.81 52.07,5.08 55.88,5.08 55.88,44.45 54.61,45.72 52.07,45.72 50.8,46.99 50.8,49.53 49.53,50.8 46.99,50.8 45.72,49.53 45.72,44.45 44.45,43.18 11.43,43.18 10.16,44.45 10.16,49.53 8.89,50.8 6.35,50.8 5.08,49.53 5.08,46.99 3.81,45.72 1.27,45.72
GPIO0
  Top 0.254: SJ5.2 16.77,38.68 16.73,38.64 RFE.P202 RFE.2 RFE.P2 9.9,38.64 7.9,40.64 ADDON.G0
GPIO1
  Top 0.254: SJ4.2 16.74,36.65 16.73,36.64 RFE.P203 RFE.P3 RFE.3 9.08,36.64 ADDON.G1
GPIO2
  Top 0.254: ADDON.G2 8.54,34.64 RFE.P4 RFE.4 RFE.P204
GPIO3
  Top 0.254: U$1.15 26.01,23.67 28.92,23.67 29.08,23.82 29.08,25.64 22.09,32.64 RFE.P205 RFE.P5 RFE.5 8,32.64 ADDON.G3
GPIO4
  Top 0.254: U$1.13 27.33,26.17 22.86,30.64 RFE.P206 RFE.6 RFE.P6 7.78,30.64 ADDON.G4
GPIO5  (via drill 0.33 pad 0.69)
  Top 0.254: ADDON.G5 8.32,28.64 RFE.7 RFE.P7 RFE.P207 18.64,28.64 18.71,28.7 SJ8.1 | VR2.3 20.36,43.49 20.2,43.66 v20.11,43.66
  Bottom 0.254: RFE.7 12.32,29.63 12.81,29.63 20.11,36.92 v20.11,43.66
GPIO6
  Top 0.254: ADDON.G6 8.86,26.64 RFE.P8 RFE.8 RFE.P208
GPIO7
  Top 0.254: U$1.10 28.65,19.48 27.23,20.91 20.47,20.91 16.73,24.64 RFE.P209 RFE.P9 RFE.9
  Bottom 0.254: 9.1,22.41 8.65,22.86 ADDON.G7 | 9.1,22.41 9.6,21.92 9.6,12.76 12.24,10.11 12.7,10.11 RXTX.4 | 9.1,22.41 11.33,24.64 RFE.9
GPIO8
  Top 0.254: U$1.12 27.99,26.11 22.46,31.64 8.49,31.64 8.38,31.75 7.14,31.75 6.36,30.96 6.36,24.87 7.09,24.13 8.41,24.13 9.9,22.64 | 9.9,22.64 RFE.P10 RFE.10 RFE.P210 | 9.9,22.64 9.9,22.61 ADDON.G8
  Bottom 0.254: RFE.10 12.32,21.65 12.73,21.65 14.73,19.64 14.73,13.15 15.24,12.65 RXTX.1
GPIO9
  Top 0.254: FTDI.5 28.39,4.63 26.5,4.63 20.53,10.59 18.11,10.59 16.22,12.48 16.22,15.49 16.73,16 16.73,20.64 RFE.P211 RFE.P11 RFE.11 10.48,20.64 ADDON.G9
GPIO10
  Top 0.254: 9.43,13.72 7.91,15.24 ADDON.G10 | FTDI.1 17.32,2.54 9.43,10.43 9.43,13.72 | 12.7,15.94 11.65,15.94 9.43,13.72 | 12.7,15.94 12.7,16.24 12.7,17.63 | 12.7,15.94 SJ3.2 | 12.7,17.63 13.89,17.63 14.9,18.64 RFE.P212 | 12.7,17.63 12.68,17.65 12.32,17.65 RFE.12 RFE.P12
GPIO11
  Top 0.254: ADDON.G11 47.91,15.24 44.51,18.64 RFE.13 RFE.P13 RFE.P213 38.9,18.64 33.02,24.52 33.02,25.18 SJ1.1
GPIO12
  Top 0.254: ADDON.G12 45.93,20.11 45.93,20.64 RFE.P14 RFE.14 RFE.P214 38.9,20.64 36.83,22.71 SJ2.1
GPIO13
  Top 0.254: RFE.15 RFE.P15 RFE.P215
  Bottom 0.254: RFE.15 44.51,22.64 46.83,20.32 ADDON.G13
GPIO14
  Top 0.254: ADDON.G14 47.71,22.86 45.93,24.64 RFE.P16 RFE.16 RFE.P216
GPIO15
  Top 0.254: ADDON.G15 47.02,26.64 RFE.17 RFE.P17 RFE.P217
GPIO16
  Top 0.254: ADDON.G16 47.56,28.64 RFE.P18 RFE.18 RFE.P218
GPIO17
  Top 0.254: SJ2.3 36.83,28.16 38.9,30.23 38.9,30.64 RFE.P219 RFE.P19 RFE.19 48.1,30.64 ADDON.G17
GPIO18  (via drill 0.33 pad 0.69)
  Top 0.254: SJ1.3 33.93,27.56 33.93,27.39 v34.53,26.8 | ADDON.G18 47.88,32.64 RFE.P20 RFE.20 RFE.P220
  Bottom 0.254: RFE.20 42.53,32.64 36.69,26.8 v34.53,26.8
GPIO19
  Top 0.254: ADDON.RESERVED 46.8,36.64 RFE.P22 RFE.22 RFE.P222
IFS
  Top 0.254: PCF2129A.P$5 30.86,35.19 28.32,37.73 PCF2129A.P$18
N$1
  Top 0.254: C13.1 25.01,17.39 25.35,17.73 U$1.5
N$2
  Top 0.254: C13.2 26.13,16.51 26.01,16.63 U$1.6
N$3
  Top 0.254: C6.1 22.64,16.51 22.64,17.09 23.37,17.82 U$1.2
N$5
  Top 0.254: C6.2 23.76,17.39 24.25,17.39 24.69,17.82 U$1.4
N$9
  Top 0.254: U$1.3 24.03,19.48 23.33,20.18 C14.1
N$10
  Top 0.254: C15.1 28.06,17.39 27.1,17.39 26.67,17.82 U$1.7
R6  (via drill 0.33 pad 0.69)
  Top 0.254: v15.8,16.11 15.3,15.61 15.1,15.61 R3.1 13.67,14.73 13.61,14.79 SJ3.1 | PCF2129A.P$17 29.59,38.73 29.51,38.73 v29.03,38.25
  Bottom 0.254: v29.03,38.25 15.8,25.02 v15.8,16.11
RESET_L
  Top 0.254: ADDON.RESET 46.26,38.64 RFE.23 RFE.P23 RFE.P223
RX0  (via drill 0.33 pad 0.69)
  Top 0.254: v25.35,23.4 U$1.16
  Bottom 0.254: UART0.3 13.2,5.08 25.35,17.23 v25.35,23.4
RX1  (via drill 0.33 pad 0.69)
  Top 0.254: U$1.9 27.99,17.82 28.58,17.82 v28.8,17.61
  Bottom 0.254: UART1.3 27.77,17.61 v28.8,17.61
RXI
  Top 0.254: RXTX.3 12.7,10.21 13.16,10.21 13.92,9.45 13.92,8.48 17.76,4.64 20.76,4.64 FTDI.2
SCL
  Top 0.254: 256.6 25.97,9.91 26.75,10.68 26.75,11.76 | 32.04,15.59 29.34,12.88 26.9,12.88 26.75,12.73 26.75,11.76 | 32.04,26.67 32.1,26.67 SJ1.2 | 32.04,26.67 29.84,26.67 25.78,30.73 PCF2129A.P$1 25.78,35.19 25.22,35.74 SJ4.1 | 32.04,15.59 32.04,26.67 | 32.04,15.59 46.19,15.59 47.85,13.93 48.8,13.93 49.49,13.24 49.49,11.39 ADDON.R5 46.61,10.16 46.35,9.89 R1.1 | 26.75,11.76 LM75A.2
SDA  (via drill 0.33 pad 0.69)
  Top 0.254: ADDON.R6 46.35,14.61 46.35,14.74 R2.1 32.74,14.74 30.41,12.4 28.54,12.4 | v44.33,21.69 44.51,21.87 44.51,23.09 43.95,23.65 39.43,23.65 37.74,25.33 37.74,26.67 SJ2.2 35.64,26.67 31.59,30.73 29.59,30.73 PCF2129A.P$4 29.59,35.19 27,37.78 SJ5.1 | 28.54,12.4 LM75A.1 | 28.54,12.4 28.54,10.16 27.02,8.64 256.5
  Bottom 0.254: v44.33,21.69 46.94,19.08 46.94,14.02 | 46.94,14.02 | ADDON.R6 46.94,14.02
TX0  (via drill 0.33 pad 0.69)
  Top 0.254: v24.28,23.14 24.69,23.54 U$1.17
  Bottom 0.254: UART0.2 10.64,5.08 14.02,8.46 14.02,9.47 14.71,10.16 15.79,10.16 24.28,18.65 v24.28,23.14
TX1  (via drill 0.33 pad 0.69)
  Top 0.254: U$1.8 27.33,19.48 27.28,19.48 v26.9,19.86
  Bottom 0.254: UART1.2 11.43,3.81 13.15,3.81 26.9,17.55 v26.9,19.86
TXO
  Top 0.254: RXTX.2 16.46,8.89 17.32,8.03 19.91,8.03 FTDI.3
VCC3  (via drill 0.33 pad 0.69)
  Top 0.254: 20.92,14.73 20.92,16.93 21.81,17.82 22.71,17.82 U$1.1 | PCF2129A.P$20 25.78,43.19 31.28,43.19 31.55,42.92 31.55,38.89 35.21,35.24 38.31,35.24 38.9,34.64 RFE.P221 RFE.P21 RFE.21 47.34,34.64 47.88,35.18 | 33.1,12.4 LM75A.8 | 33.1,12.4 33.1,12.12 34.01,11.21 34.29,11.21 C2.1 34.73,10.53 35.17,10.53 35.22,10.48 VR1.5 | 22.08,28.3 22.49,28.71 C16.1 | 22.08,28.3 22.08,26.61 23.37,25.32 U$1.19 23.37,23.16 25.06,21.47 27.25,21.47 30.54,18.17 30.54,15.03 v29.56,14.05 27.43,14.05 25.97,12.59 25.97,12.45 256.8 23.89,12.45 23.2,12.45 20.92,14.73 | 22.08,28.3 | 22.08,28.3 21.68,28.7 SJ8.3 | 47.88,35.18 ADDON.VCC 49.92,37.22 49.92,37.96 C5.2 C7.2 | 47.88,35.18 49.95,33.11 49.95,10.1 48.77,8.92 45.02,8.92 44.59,9.35 44.59,10.48 45.13,11.02 45.47,11.02 R1.2 R2.2 44.59,12.94 44.52,13.01 33.68,13.01 33.1,12.4 | 20.92,14.73 17.24,14.73 R3.2
  Bottom 0.254: SJ7.3 30.26,6.35 30.26,6.95 28.87,8.34 | 28.87,8.34 26.89,6.35 SJ6.1 | 28.87,8.34 29.56,9.02 v29.56,14.05 29.56,22.78 41.42,34.64 RFE.21
VCC3A
  Top 0.254: VR2.5 16.42,41.59 10.03,47.98 | 10.03,47.98 7.9,47.98 ADDON.R1 | 10.03,47.98 C4.1
VIN  (1 unrouted)
  Top 0.254: 40.33,10.53 40.28,10.48 VR1.1 38.52,10.48 38.32,10.28 38.32,8.63 | 40.33,10.53 40.33,12.33 40.28,12.38 VR1.3 | 38.32,8.63 39.34,7.62 D2.C | 38.32,8.63 35.19,8.63 31.75,5.19 31.75,2.08 30.98,1.31 16.28,1.31 13.78,3.81 12.17,3.81 11.48,4.5 11.48,6.3 ADDON.R4 5.95,11.83 5.95,40.7 7.16,41.91 9.11,41.91 11.37,39.66 18.42,39.66 20.36,41.59 VR2.1 22.29,41.59 22.74,41.14 C3.1 | 40.33,10.53 C1.1
VIN_PREDIODE
  Top 0.254: 38.1,6.35 38.1,6.38 36.86,7.62 D2.A | VIN.1 38.1,6.35 | 38.1,6.35 SCT.1

### Text on the board
tPlace: Vcc3Aux | SNARF Base | 3.i5 20110403 | GND | GND | GPIO0 | !RESET | GPIO1 | GPIO2 | I2C | 300 | Vcc3 | GPIO3 | GP_18 | GPIO4 | RF100 | GP_17 | GPIO5 | + | GP_16 | GPIO6 | I2C | RF200 | GP_15 | GPIO7 | GP_14 | GPIO8 | GP_13 | GPIO9 | GP_12 | GP_10 | RTC_INT | + | + | + | GP_11 | R3 | =Xover | SDA | VIN | = | SCL | + | Pull-Ups | GND | TX | RX | + | U0 | RXI | TXO | Vcc | CTS | GND | +VIN- | U1 | - | +
bPlace: J.C. Woltz | Serge Sozonoff | SJ Left normal | SJ Right Reversed | + | - | +